# EasyEDA schematic schematic.json
TITLE: Drone main PCB; REV: 1.0; Date: 2021-08-20; Sheet: 1/1; Company: Endurance
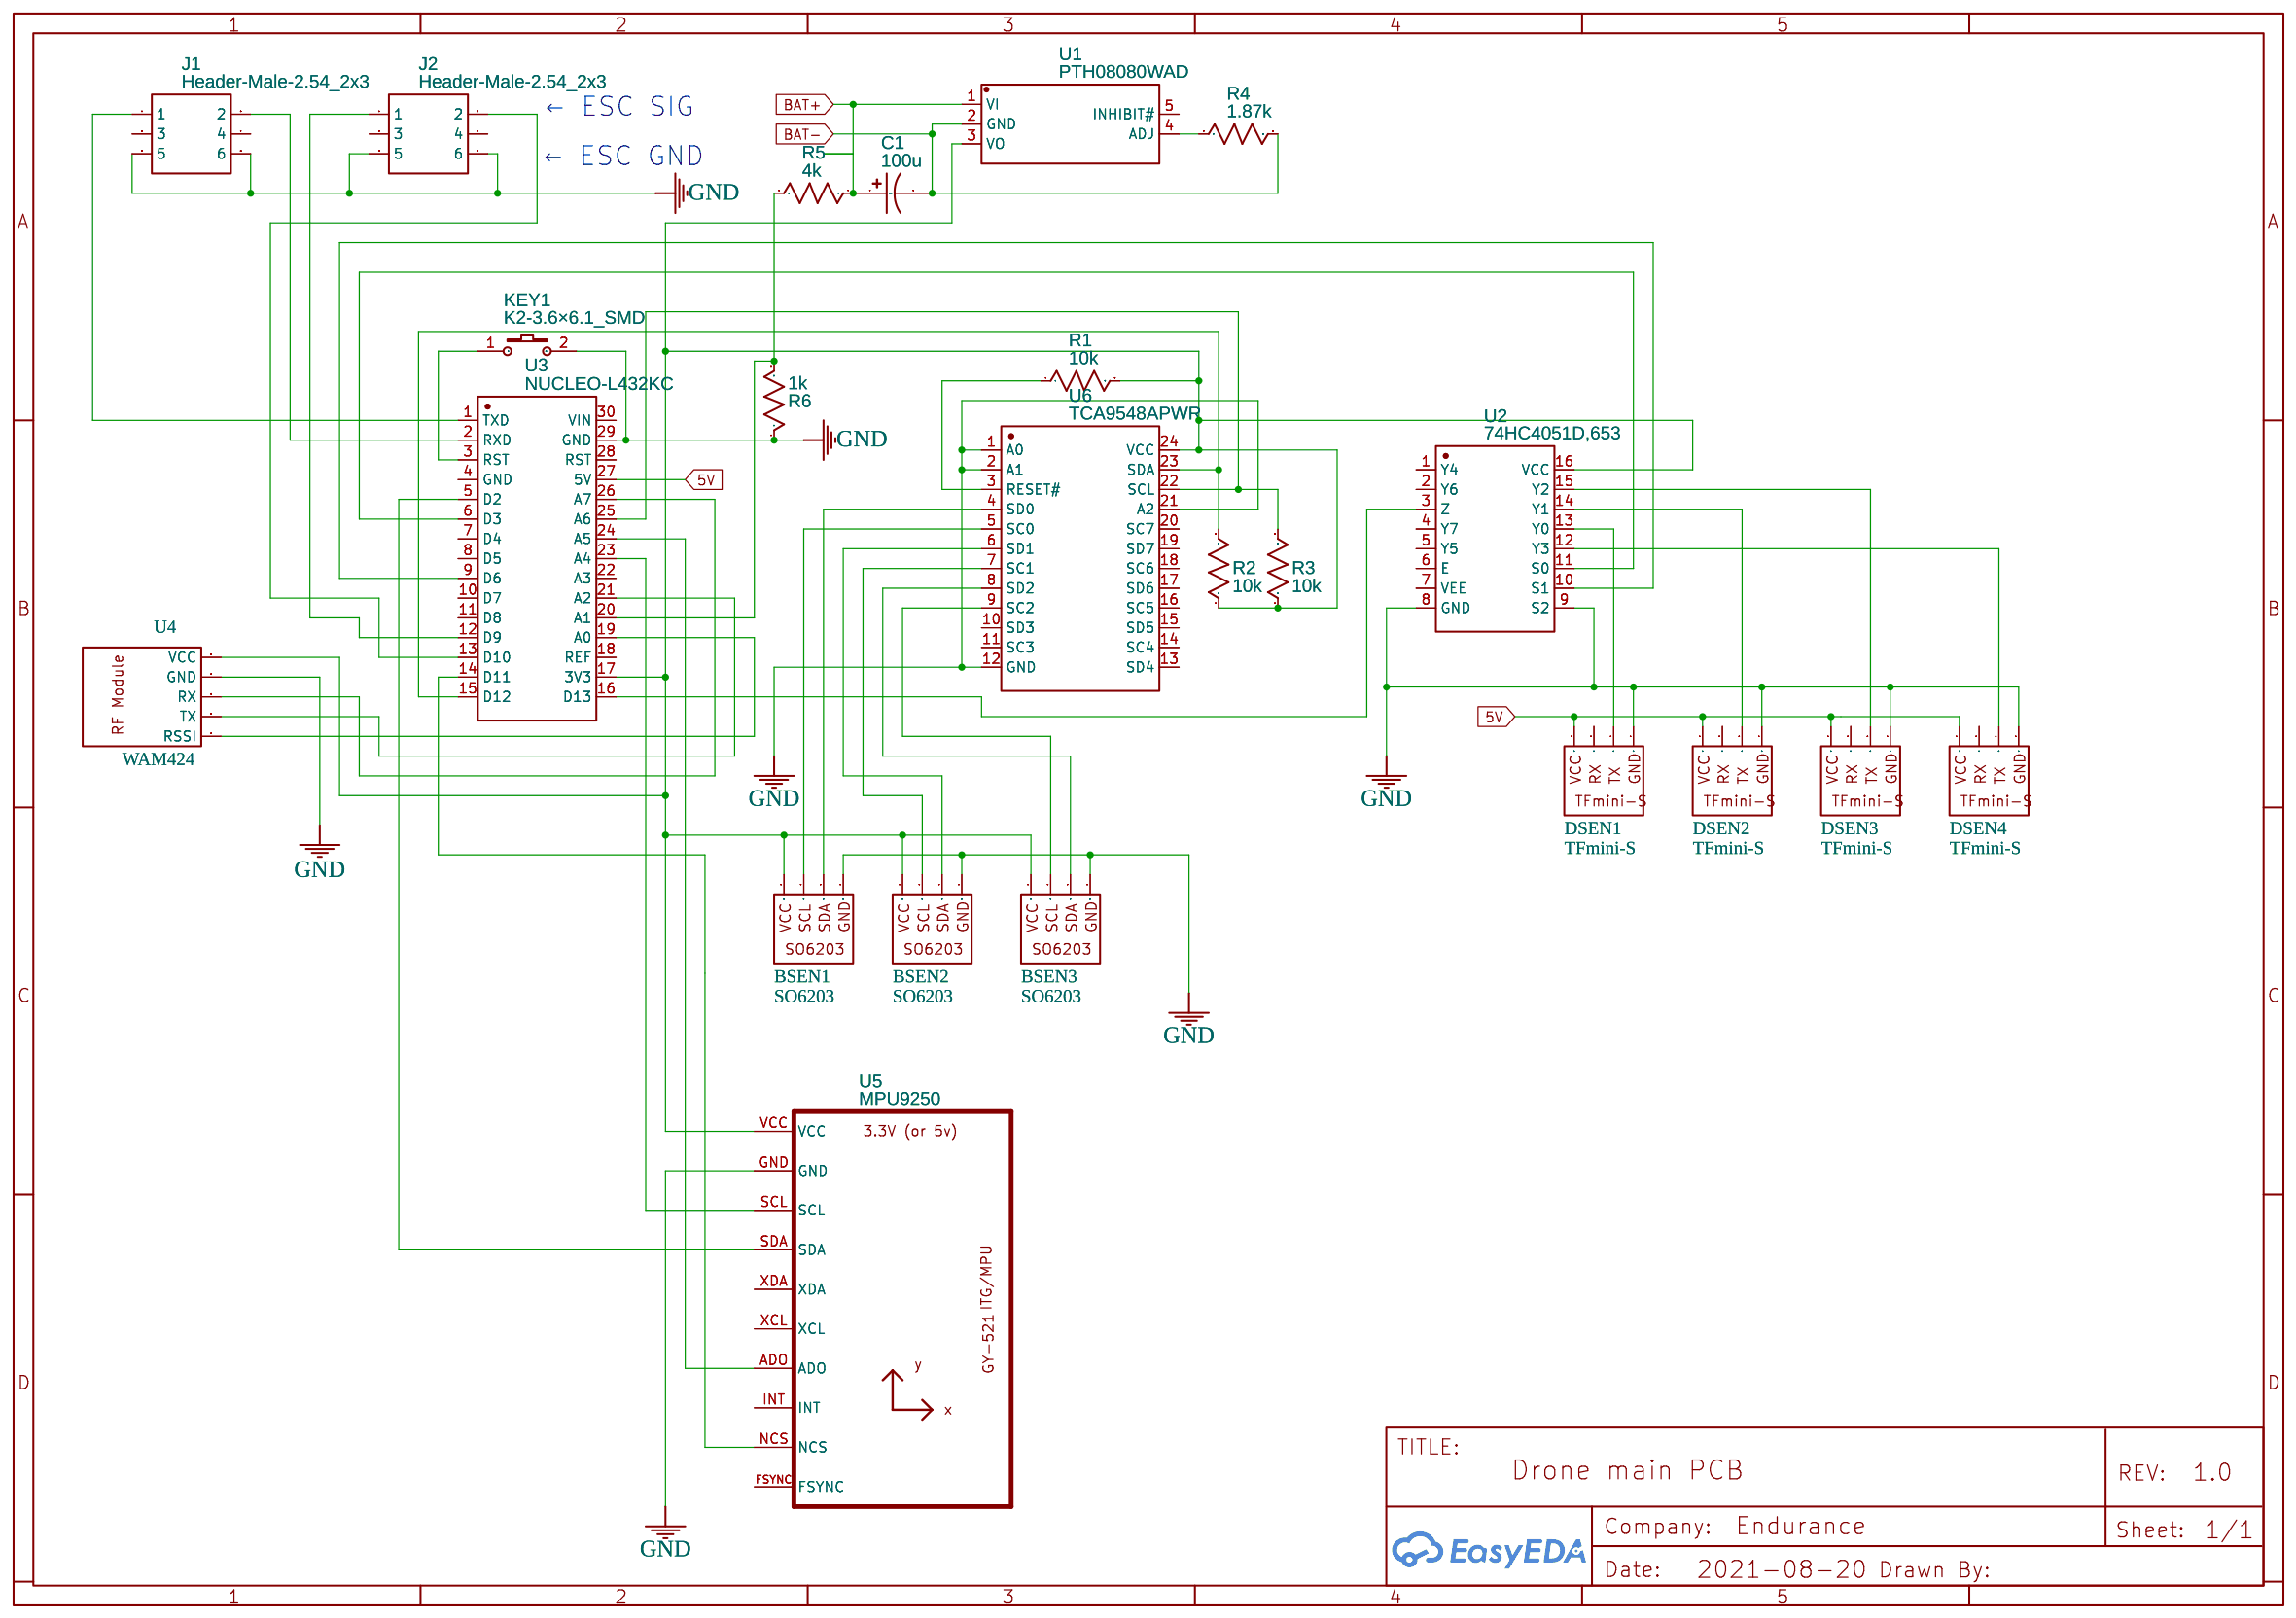
[diagram p0: schematic sheet]

## Parts
BSEN1  SO6203
BSEN2  SO6203
BSEN3  SO6203
C1  100u  [CASE-A_3216]
DSEN1  TFmini-S
DSEN2  TFmini-S
DSEN3  TFmini-S
DSEN4  TFmini-S
J1  Header-Male-2.54_2x3  [HDR-TH_6P-P2.54-V-M-R2-C3-S2.54-1]
J2  Header-Male-2.54_2x3  [HDR-TH_6P-P2.54-V-M-R2-C3-S2.54-1]
KEY1  K2-3.6×6.1_SMD  [KEY-SMD_2P-L6.2-W3.6-LS8.0]
R1  10k  [R0603]
R2  10k  [R0603]
R3  10k  [R0603]
R4  1.87k  [R0603]
R5  4k  [R0603]
R6  1k  [R0603]
U1  PTH08080WAD  [PWRM-TH_5P-L16.3-W13.7-P3.56]
U2  74HC4051D,653  [SOIC-16_L9.9-W3.9-P1.27-LS6.0-BL]
U3  NUCLEO-L432KC  [DIP-30_L51.0-W17.8-P2.54-LS15.2-TL]
U4  WAM424
U5  MPU9250  [GY-521]
U6  TCA9548APWR  [TSSOP-24_L7.8-W4.4-P0.65-LS6.4-BL]

## Library data of the parts
C1 = C_Tan_SMD_A_US: Contributor: LCEDA_Lib
J1 J2 = Header-Male-2.54_2x3: Supplier: LCSC; Manufacturer: BOOMELE; Supplier Part: C65114; JLCPCB Part Class: Extended Part
KEY1 = K2-3.6×6.1_SMD: Supplier Part: C118141; Supplier: LCSC; Manufacturer Part: K2-1107ST-A4SW-06; Contributor: LCEDA_Lib; 制造商: 韩国韩荣
R1-R6 = R_0603_US: Contributor: LCEDA_Lib
U1 = PTH08080WAD: Supplier: LCSC; Supplier Part: C154927; Manufacturer: Texas Instruments; Contributor: LCSC; JLCPCB Part Class: Extended Part
U2 = 74HC4051D,653: Supplier: LCSC; Manufacturer: Nexperia; Supplier Part: C9386; JLCPCB Part Class: Extended Part
U3 = NUCLEO-L432KC: Supplier: LCSC; Manufacturer: STMicroelectronics; Supplier Part: C94814; JLCPCB Part Class: Extended Part
U5 = MPU9250: Contributor: StefMas
U6 = TCA9548APWR: Supplier: LCSC; Manufacturer: TI; Supplier Part: C130026; JLCPCB Part Class: Extended Part

## Nets
5V: BSEN1.1 BSEN2.1 BSEN3.1 DSEN1.1 DSEN2.1 DSEN3.1 DSEN4.1 J1.5 J1.6 J2.5 J2.6 KEY1.2 R1.2 R2.1 R3.1 R6.1 U1.3(VO) U2.8(GND) U2.9(S2) U2.12(Y3) U2.13(Y0) U2.14(Y1) U2.15(Y2) U2.16(VCC) U3.17(3V3) U3.19(A0) U3.21(A2) U3.26(A7) U3.27(5V) U3.29(GND) U4.3(VCC) U5.GND U5.VCC U6.1(A0) U6.2(A1) U6.4(SD0) U6.5(SC0) U6.6(SD1) U6.7(SC1) U6.8(SD2) U6.9(SC2) U6.12(GND) U6.21(A2) U6.24(VCC)
BAT+: C1.1 R5.1 U1.1(VI)
BAT-: C1.2 R4.2 U1.2(GND)
Net-(J1-1): J1.1 U3.1(TXD)
Net-(J1-2): J1.2 U3.2(RXD)
Net-(J2-1): J2.1 U3.12(D9)
Net-(J2-2): J2.2 U3.13(D10)
Net-(KEY1-1): KEY1.1 U3.3(RST)
Net-(R1-1): R1.1 U6.3(RESET#)
Net-(R2-2): R2.2 U3.15(D12) U6.23(SDA)
Net-(R3-2): R3.2 U3.25(A6) U6.22(SCL)
Net-(R4-1): R4.1 U1.4(ADJ)
Net-(R5-2): R5.2 R6.2 U3.20(A1)
Net-(U2-3): U2.3(Z) U3.16(D13)
Net-(U2-10): U2.10(S1) U3.9(D6)
Net-(U2-11): U2.11(S0) U3.6(D3)
Net-(U3-5): U3.5(D2) U5.SDA
Net-(U3-14): U3.14(D11) U5.NCS
Net-(U3-23): U3.23(A4) U5.SCL
Net-(U3-24): U3.24(A5) U5.ADO

Not connected (* = marked no-connect by the designer): J1 3 4; J2 3 4; U1 5(INHIBIT#); U2 1(Y4) 2(Y6) 4(Y7) 5(Y5) 6(E) 7(VEE); U3 4(GND) 7(D4) 8(D5) 10(D7) 11(D8) 18(REF) 22(A3) 28(RST) 30(VIN); U5 FSYNC INT XCL XDA; U6 10(SD3) 11(SC3) 13(SD4) 14(SC4) 15(SD5) 16(SC5) 17(SD6) 18(SC6) 19(SD7) 20(SC7)

## Notes on the sheet
- ← ESC SIG
- ← ESC GND
- 김정현
